# Altium project Wally_StepperMotorAuxBoard.PrjPcb
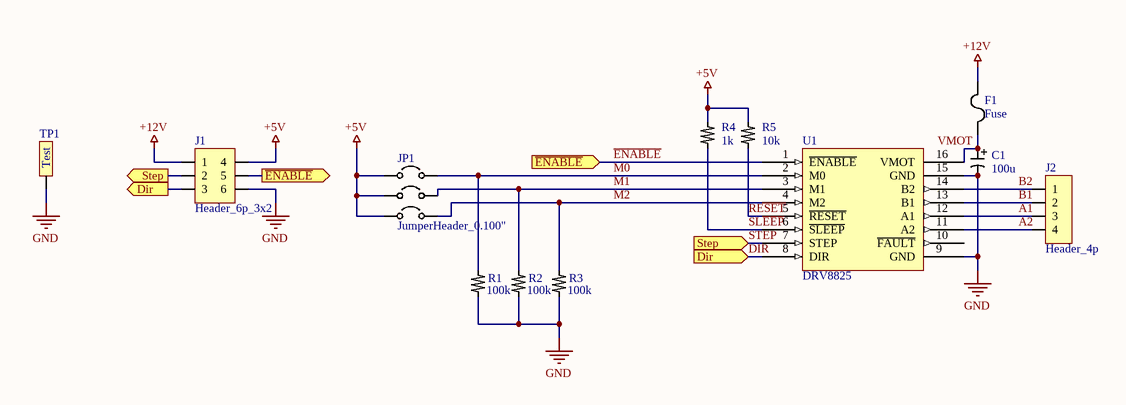
[diagram p0: StepperMotorAuxBoard.SchDoc]
1 sheet, 12 parts. Net scope: flat (ports and power ports of the same name join across sheets).
Board file: StepperMotorAuxBoard.PcbDoc

## Sheet StepperMotorAuxBoard.SchDoc
size A4; SheetNumber: 1; SheetTotal: 1

### Parts
C1  100u  [Capacitor_UVZ2A101MPD]
F1  Fuse  [1812_PTC]
J1  Header_6p_3x2  [MOLEX_MiniFitJr_6p]
J2  Header_4p  [JST-XH_4p]
JP1  JumperHeader_0.100"  [JumperHeader_0.100"]
R1  100k  [0805]
R2  100k  [0805]
R3  100k  [0805]
R4  1k  [0805]
R5  10k  [0805]
TP1  TestPoint  [TestPoint]  (value not drawn)
U1  DRV8825  [DRV8825]

### Ports
Dir (in), Dir (out), Step (in), Step (out), ~{ENABLE} (in), ~{ENABLE} (out)

### Nets
+5V: J1.4 JP1.2 JP1.4 JP1.6 R4.2 R5.2
+12V: F1.2 J1.1
GND: C1.K J1.6 R1.1 R2.1 R3.1 TP1.1 U1.9(GND) U1.15(GND)
A1: J2.3 U1.12(A1)
A2: J2.4 U1.11(A2)
B1: J2.2 U1.13(B1)
B2: J2.1 U1.14(B2)
DIR: J1.3 U1.8(DIR) ; port Dir
~{ENABLE}: J1.5 U1.1(~{ENABLE}) ; port ~{ENABLE}
M0: JP1.1 R1.2 U1.2(M0)
M1: JP1.3 R2.2 U1.3(M1)
M2: JP1.5 R3.2 U1.4(M2)
~{RESET}: R5.1 U1.5(~{RESET})
~{SLEEP}: R4.1 U1.6(~{SLEEP})
STEP: J1.2 U1.7(STEP) ; port Step
NetC1_A: C1.A F1.1 U1.16(VMOT)

Not connected (* = marked no-connect by the designer): U1 10(~{FAULT})

### Notes on the sheet
- Labels drawn without touching a wire or pin: VMOT
- (in symbol Capacitor Polarized) +
- (in symbol TestPoint) Test

### Library data of the parts
C1 = Capacitor Polarized: pin to pad: A>1 K>2
R1-R5 = Resistor
U1 = DRV8825: Stepper motor driver